# Altium schematic sheet Diagram_Signal.SchDoc
size A
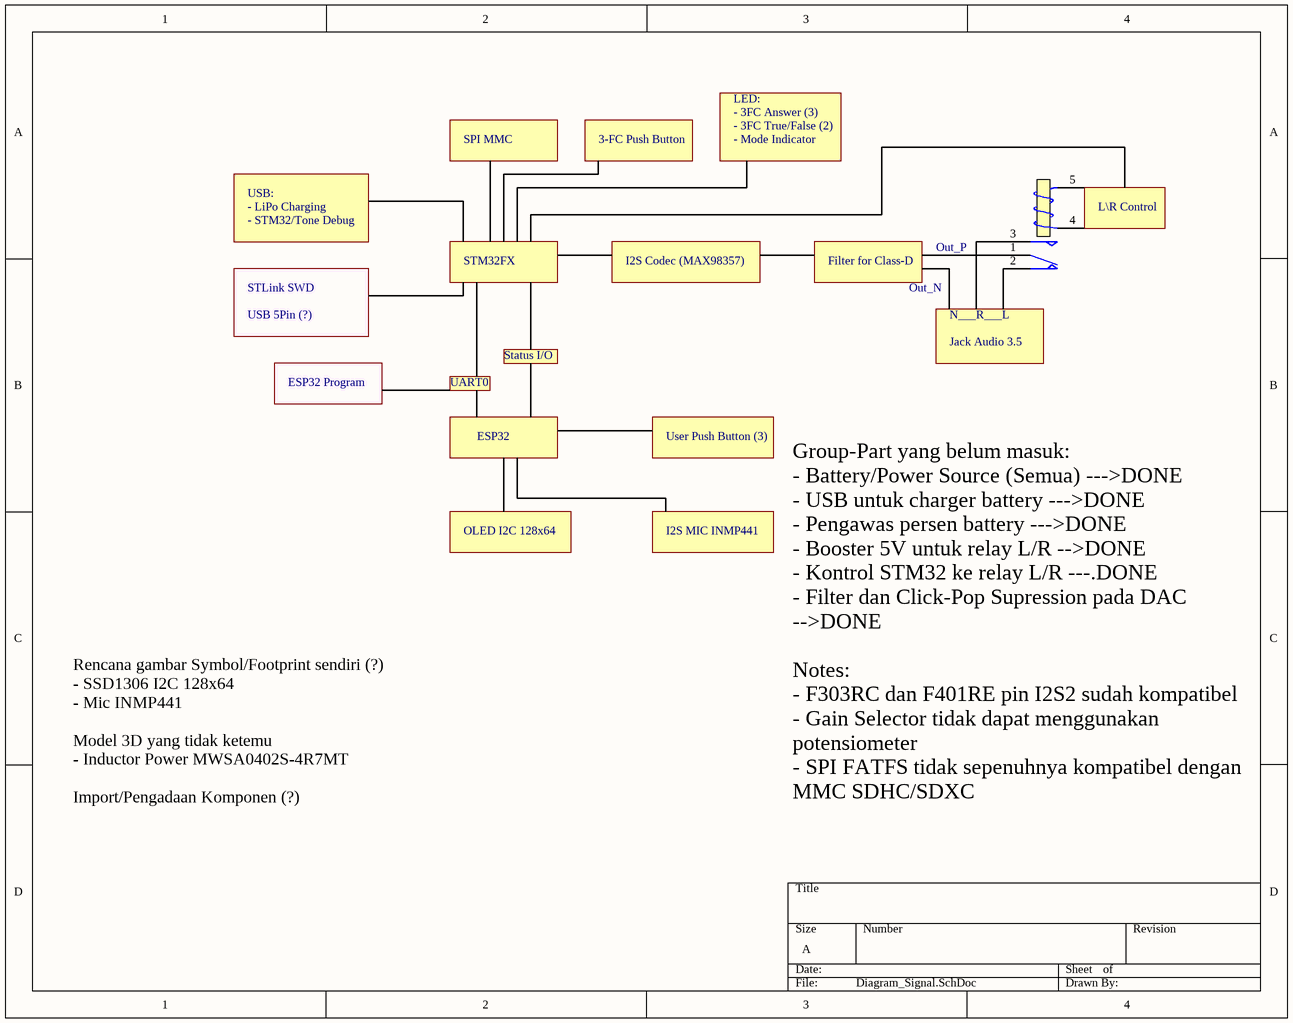
[diagram p0: Diagram_Signal.SchDoc]

## Parts
6  (no value)

## Nets

Not connected (* = marked no-connect by the designer): 6 1(COM) 2(NC) 3(NO) 4(T1) 5(T2)

## Notes on the sheet
- LED:
- SPI MMC
- 3-FC Push Button
- - 3FC Answer (3)
- - 3FC True/False (2)
- - Mode Indicator
- USB:
- - LiPo Charging
- - STM32/Tone Debug
- (near 6) L\R Control
- STLink SWD
- STM32FX
- I2S Codec (MAX98357)
- Filter for Class-D
- Out_N
- Out_P
- USB 5Pin (?)
- Status I/O
- Jack Audio 3.5
- (near 6) N___R___L
- ESP32 Program
- UART0
- ESP32
- User Push Button (3)
- OLED I2C 128x64
- I2S MIC INMP441
- Rencana gambar Symbol/Footprint sendiri (?)
  - SSD1306 I2C 128x64
  - Mic INMP441
  Model 3D yang tidak ketemu
  - Inductor Power MWSA0402S-4R7MT
  Import/Pengadaan Komponen (?)
- Group-Part yang belum masuk:
  - Battery/Power Source (Semua) --->DONE
  - USB untuk charger battery --->DONE
  - Pengawas persen battery --->DONE
  - Booster 5V untuk relay L/R -->DONE
  - Kontrol STM32 ke relay L/R ---.DONE
  - Filter dan Click-Pop Supression pada DAC -->DONE
  Notes:
  - F303RC dan F401RE pin I2S2 sudah kompatibel
  - Gain Selector tidak dapat menggunakan potensiometer
  - SPI FATFS tidak sepenuhnya kompatibel dengan MMC SDHC/SDXC

## Library data of the parts
6 = Relay: SPDT Relay; Published: 8-Jun-2000; LatestRevisionDate: 17-Jul-2002; LatestRevisionNote: Re-released for DXP Platform.; PackageReference: MODULE5B; Publisher: Altium Limited